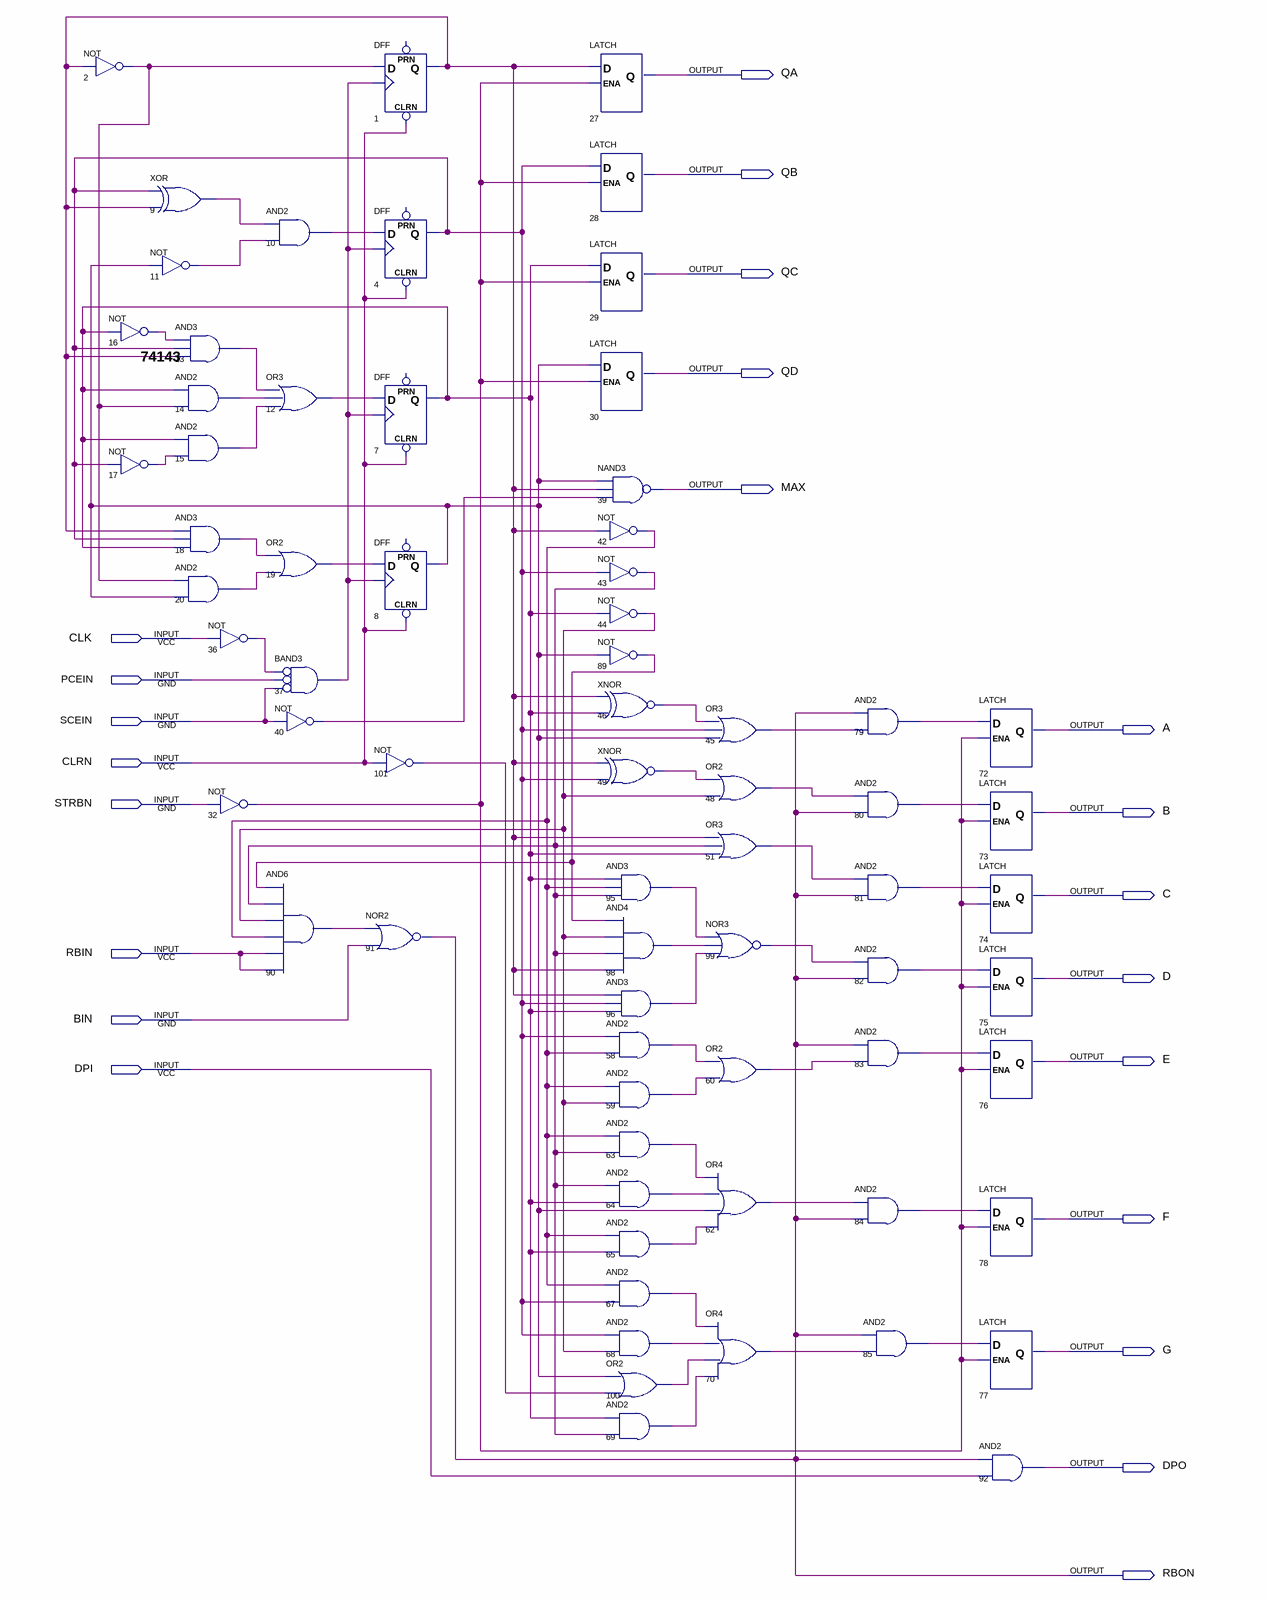
[diagram p0: schematic sheet]
// Quartus schematic 74143.bdf as structural Verilog: 69 symbols, 22 pins
module \74143  (
  input  CLK,
  input  PCEIN,
  input  SCEIN,
  input  CLRN,
  input  STRBN,
  input  RBIN,
  input  BIN,
  input  DPI,
  output QA,
  output QB,
  output QC,
  output QD,
  output MAX,
  output A,
  output B,
  output C,
  output D,
  output E,
  output F,
  output G,
  output DPO,
  output RBON
);

  wire \74143 , n1_q, n2_out, n7_q, n8_q, n9_out, n10_out, n11_out, n12_out, n13_out, n14_out, n15_out,
       n16_out, n17_out, n18_out, n19_out, n20_out, n32_out, n36_out, n37_out, n40_out, n42_out, n43_out,
       n44_out, n45_out, n46_out, n48_out, n49_out, n51_out, n58_out, n59_out, n60_out, n62_out, n63_out,
       n64_out, n65_out, n67_out, n68_out, n69_out, n70_out, n79_out, n80_out, n81_out, n82_out, n83_out,
       n84_out, n85_out, n89_out, n90_out, n95_out, n96_out, n98_out, n99_out, n100_out, n101_out;

  not u_2 (n2_out, n1_q);
  not u_16 (n16_out, n7_q);
  not u_17 (n17_out, \74143 );
  xor u_9 (n9_out, \74143 , n1_q);
  not u_11 (n11_out, n8_q);
  and u_13 (n13_out, n16_out, \74143 , n1_q);
  and u_14 (n14_out, n7_q, n2_out);
  and u_15 (n15_out, n7_q, n17_out);
  and u_18 (n18_out, n1_q, \74143 , n7_q);
  and u_20 (n20_out, n2_out, n8_q);
  not u_36 (n36_out, CLK);
  not u_32 (n32_out, STRBN);
  and u_10 (n10_out, n9_out, n11_out);
  or u_12 (n12_out, n13_out, n14_out, n15_out);
  or u_19 (n19_out, n18_out, n20_out);
  and u_37 (n37_out, ~n36_out, ~PCEIN, ~SCEIN);  // BAND3
  not u_40 (n40_out, SCEIN);
  and u_90 (n90_out, n89_out, n43_out, n44_out, n42_out, RBIN, RBIN);
  DFF u_1 (.CLRN(CLRN), .CLK(n37_out), .D(n2_out), .Q(n1_q));  // open: PRN
  DFF u_4 (.CLRN(CLRN), .CLK(n37_out), .D(n10_out), .Q(\74143 ));  // open: PRN
  DFF u_7 (.CLRN(CLRN), .CLK(n37_out), .D(n12_out), .Q(n7_q));  // open: PRN
  DFF u_8 (.CLRN(CLRN), .CLK(n37_out), .D(n19_out), .Q(n8_q));  // open: PRN
  not u_101 (n101_out, CLRN);
  nor u_91 (RBON, n90_out, BIN);
  LATCH u_27 (.D(n1_q), .ENA(n32_out), .Q(QA));
  LATCH u_28 (.D(\74143 ), .ENA(n32_out), .Q(QB));
  LATCH u_29 (.D(n7_q), .ENA(n32_out), .Q(QC));
  LATCH u_30 (.D(n8_q), .ENA(n32_out), .Q(QD));
  nand u_39 (MAX, n8_q, n1_q, n40_out);
  not u_42 (n42_out, n1_q);
  not u_43 (n43_out, \74143 );
  not u_44 (n44_out, n7_q);
  not u_89 (n89_out, n8_q);
  xnor u_46 (n46_out, n1_q, n7_q);
  xnor u_49 (n49_out, n1_q, \74143 );
  and u_95 (n95_out, n7_q, n42_out, n43_out);
  and u_98 (n98_out, n89_out, n44_out, n43_out, n1_q);
  and u_96 (n96_out, n1_q, \74143 , n7_q);
  and u_58 (n58_out, \74143 , n42_out);
  and u_59 (n59_out, n42_out, n44_out);
  and u_63 (n63_out, n42_out, n43_out);
  and u_64 (n64_out, n43_out, n7_q);
  and u_65 (n65_out, n42_out, n7_q);
  and u_67 (n67_out, n42_out, \74143 );
  and u_68 (n68_out, \74143 , n44_out);
  or u_100 (n100_out, n8_q, n101_out);
  and u_69 (n69_out, n7_q, n43_out);
  or u_45 (n45_out, n46_out, \74143 , n8_q);
  or u_48 (n48_out, n49_out, n44_out);
  or u_51 (n51_out, n1_q, n43_out, n7_q);
  nor u_99 (n99_out, n95_out, n98_out, n96_out);
  or u_60 (n60_out, n58_out, n59_out);
  or u_62 (n62_out, n63_out, n64_out, n8_q, n65_out);
  or u_70 (n70_out, n67_out, n68_out, n100_out, n69_out);
  and u_79 (n79_out, RBON, n45_out);
  and u_80 (n80_out, n48_out, RBON);
  and u_81 (n81_out, n51_out, RBON);
  and u_82 (n82_out, n99_out, RBON);
  and u_83 (n83_out, RBON, n60_out);
  and u_84 (n84_out, n62_out, RBON);
  and u_85 (n85_out, RBON, n70_out);
  LATCH u_72 (.D(n79_out), .ENA(n32_out), .Q(A));
  LATCH u_73 (.D(n80_out), .ENA(n32_out), .Q(B));
  LATCH u_74 (.D(n81_out), .ENA(n32_out), .Q(C));
  LATCH u_75 (.D(n82_out), .ENA(n32_out), .Q(D));
  LATCH u_76 (.D(n83_out), .ENA(n32_out), .Q(E));
  LATCH u_78 (.D(n84_out), .ENA(n32_out), .Q(F));
  LATCH u_77 (.D(n85_out), .ENA(n32_out), .Q(G));
  and u_92 (DPO, RBON, DPI);
endmodule
